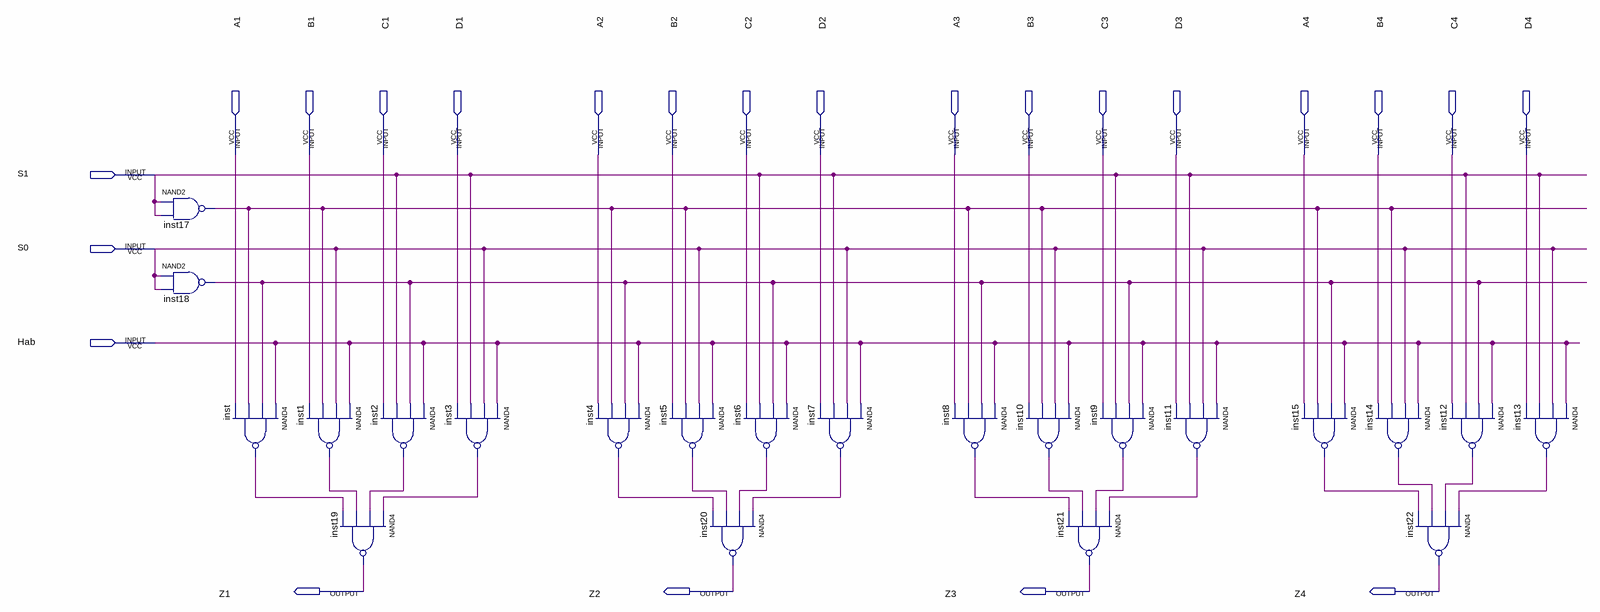
[diagram p0: schematic sheet]
// Quartus schematic Mux.bdf as structural Verilog: 22 symbols, 23 pins
module Mux (
  input  A1,
  input  B1,
  input  C1,
  input  D1,
  input  A2,
  input  B2,
  input  C2,
  input  D2,
  input  A3,
  input  B3,
  input  C3,
  input  D3,
  input  A4,
  input  B4,
  input  C4,
  input  D4,
  input  S1,
  input  S0,
  input  Hab,
  output Z1,
  output Z2,
  output Z3,
  output Z4
);

  wire inst1_out, inst2_out, inst3_out, inst4_out, inst5_out, inst6_out, inst7_out, inst8_out, inst9_out,
       inst10_out, inst11_out, inst12_out, inst13_out, inst14_out, inst15_out, inst17_out, inst18_out,
       inst_out;

  nand inst17 (inst17_out, S1, S1);
  nand inst18 (inst18_out, S0, S0);
  nand inst (inst_out, Hab, inst18_out, inst17_out, A1);
  nand inst1 (inst1_out, Hab, S0, inst17_out, B1);
  nand inst19 (Z1, inst3_out, inst2_out, inst1_out, inst_out);
  nand inst2 (inst2_out, Hab, inst18_out, S1, C1);
  nand inst3 (inst3_out, Hab, S0, S1, D1);
  nand inst4 (inst4_out, Hab, inst18_out, inst17_out, A2);
  nand inst5 (inst5_out, Hab, S0, inst17_out, B2);
  nand inst20 (Z2, inst7_out, inst6_out, inst5_out, inst4_out);
  nand inst6 (inst6_out, Hab, inst18_out, S1, C2);
  nand inst7 (inst7_out, Hab, S0, S1, D2);
  nand inst8 (inst8_out, Hab, inst18_out, inst17_out, A3);
  nand inst10 (inst10_out, Hab, S0, inst17_out, B3);
  nand inst21 (Z3, inst11_out, inst9_out, inst10_out, inst8_out);
  nand inst9 (inst9_out, Hab, inst18_out, S1, C3);
  nand inst11 (inst11_out, Hab, S0, S1, D3);
  nand inst15 (inst15_out, Hab, inst18_out, inst17_out, A4);
  nand inst14 (inst14_out, Hab, S0, inst17_out, B4);
  nand inst22 (Z4, inst13_out, inst12_out, inst14_out, inst15_out);
  nand inst12 (inst12_out, Hab, inst18_out, S1, C4);
  nand inst13 (inst13_out, Hab, S0, S1, D4);
endmodule
